# Altium schematic sheet DSO_Trig.SchDoc: Schematic_Name
size A4; CompanyName: University of Melbourne; Engineer: Your Name Here; DocumentNumber: 1; Revision: 0.1; SheetNumber: 1; SheetTotal: 1; Title_Project: Project_Title; StudentNo: Student No.
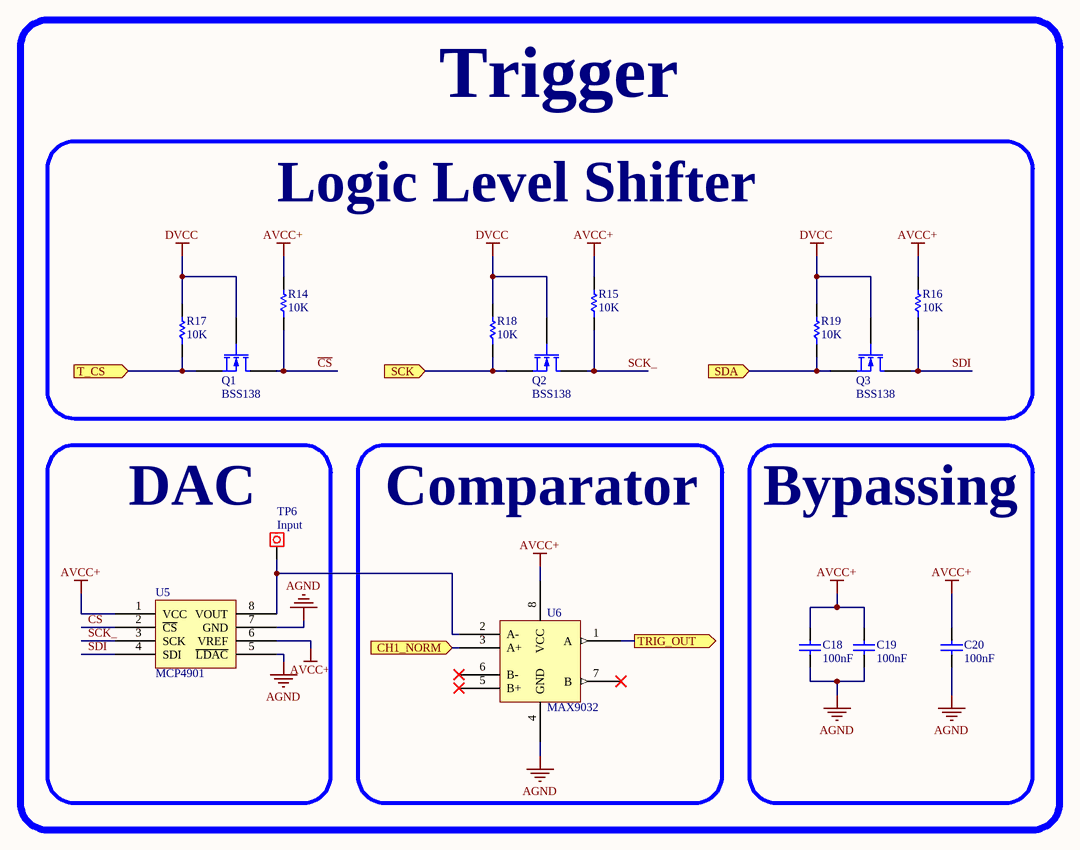
[diagram p0: DSO_Trig.SchDoc]

## Parts
C18  100nF  [0805C]
C19  100nF  [0805C]
C20  100nF  [0805C]
Q1  BSS138  [SOT23]
Q2  BSS138  [SOT23]
Q3  BSS138  [SOT23]
R14  10K  [0805]
R15  10K  [0805]
R16  10K  [0805]
R17  10K  [0805]
R18  10K  [0805]
R19  10K  [0805]
TP6  INPUT  [Testpoin]
U5  MCP4901  [SOIC-8]
U6  MAX9032  [SOIC-8]

## Blocks framed on the sheet
Logic Level Shifter: Q1-Q3 R14-R19
DAC: TP6 U5
Comparator: U6
Bypassing: C18-C20

## Ports
CH1_NORM (in), SCK (in), SDA (in), T_CS (in), TRIG_OUT (out)

## Nets
AGND: C18.1 C19.1 C20.1 U5.5(~{LDAC}) U5.7(GND) U6.4(GND)
AVCC+: C18.2 C19.2 C20.2 R14.2 R15.2 R16.2 U5.1(VCC) U5.6(VREF) U6.8(VCC)
DVCC: Q1.1 Q2.1 Q3.1 R17.2 R18.2 R19.2
~{CS}: Q1.3 R14.1 U5.2(~{CS})
CH1_NORM: U6.3(A+) ; port CH1_NORM
SCK: Q2.2 R18.1 ; port SCK
SCK_: Q2.3 R15.1 U5.3(SCK)
SDA: Q3.2 R19.1 ; port SDA
SDI: Q3.3 R16.1 U5.4(SDI)
T_CS: Q1.2 R17.1 ; port T_CS
TRIG_OUT: U6.1(A) ; port TRIG_OUT
NetTP6_1: TP6.1 U5.8(VOUT) U6.2(A-)

Not connected (* = marked no-connect by the designer): U6 5(B+)* 6(B-)* 7(B)*

## Notes on the sheet
- Trigger

## Library data of the parts
C18-C20 = C: Capacitor; Reviewed by: RM - 2018/08/05; Revision: July-2002: Re-released for DXP Platform.; Supplier 1: *; Supplier Part Number 1: *; Value: 100nF
Q1-Q3 = MOSFET-N: N-Channel MOSFET; PackageDocument: 1995/1996; Published: 8-Jun-2000; LatestRevisionDate: 17-Jul-2002; LatestRevisionNote: Re-released for DXP Platform.; PackageReference: E3; Publisher: Altium Limited
R14-R19 = R: Resistor; Reviewed by: RM - 2018/08/05; Supplier 1: *; Suppler Part Number 1: *; Value: 10K
TP6 = Test Point: Pad; Value: Input
U5 = MCP4901: DAC 8bit SPI; Reviewed by: RM - 2018/08/05; Supplier 1: Digi-Key; Supplier Part Number 1: MCP4901-E/SN-ND
U6 = MAX9032: Dual Comparator; Reviewed by: RM - 2018/08/05; Supplier 1: Digi-Key; Supplier Part Number 1: MAX9032ASA-ND